# Altium schematic sheet SIM7600x.SchDoc
size A3; SheetNumber: 5; SheetTotal: 7
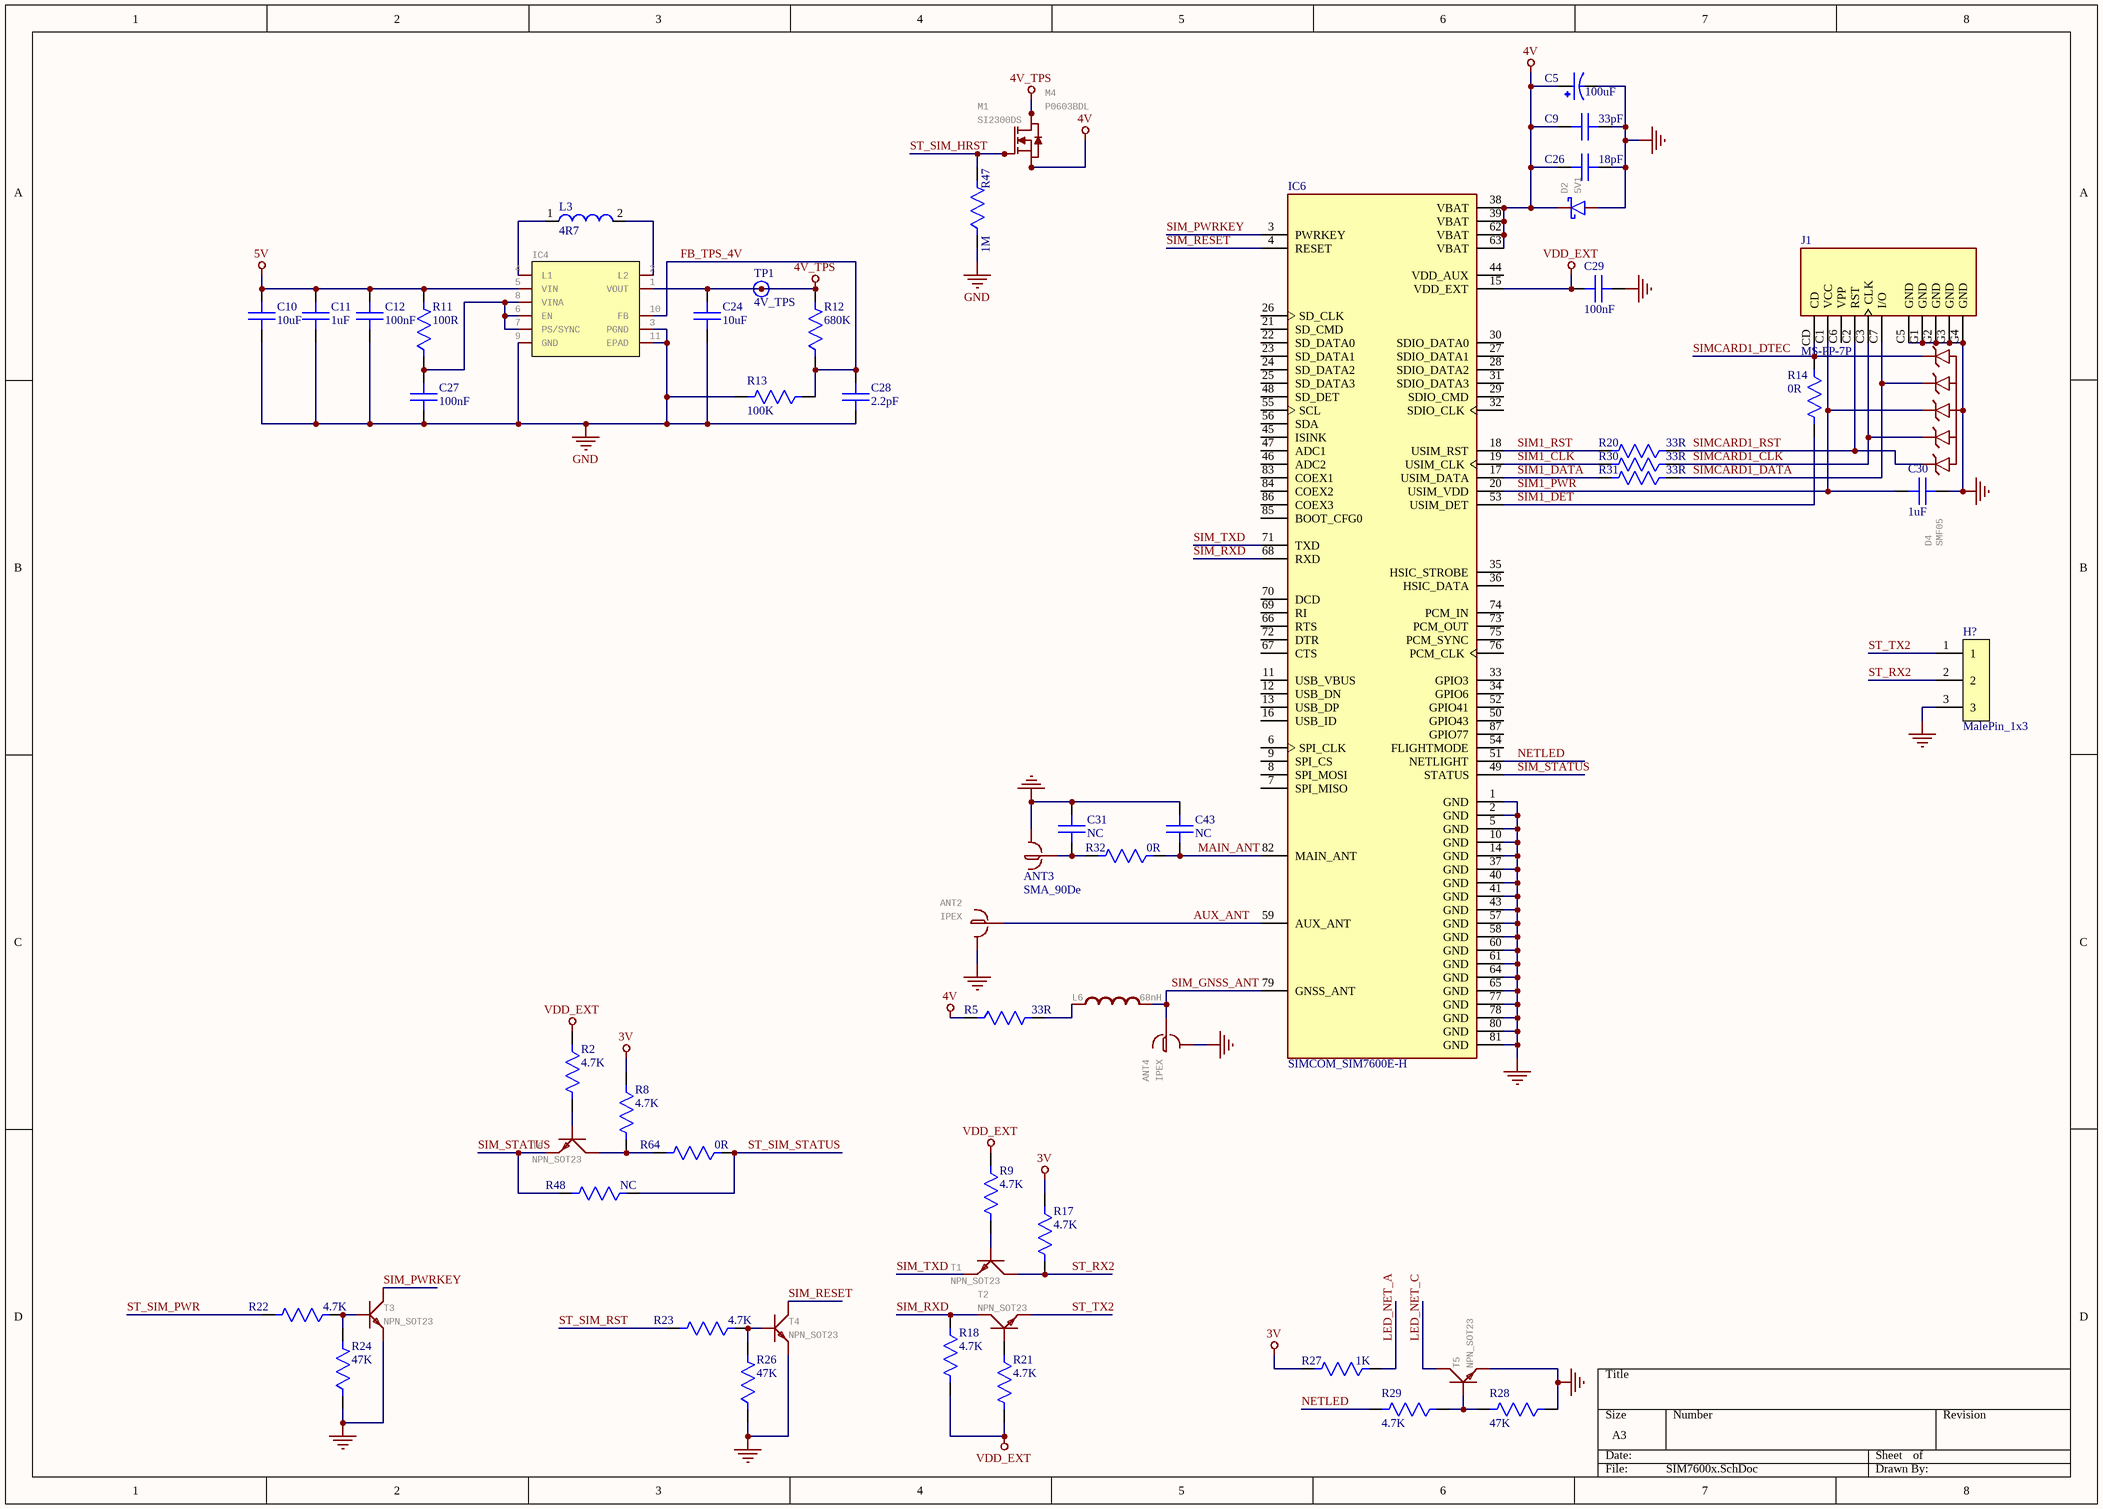
[diagram p0: SIM7600x.SchDoc]

## Parts
ANT2  IPEX  [IPEX]
ANT3  SMA_90De  [SMA_90De]
ANT4  IPEX  [IPEX]
C5  100uF  [1411P]
C9  33pF  [C0603]
C10  10uF  [C0603]
C11  1uF  [C0603]
C12  100nF  [C0603]
C24  10uF  [C0603]
C26  18pF  [C0603]
C27  100nF  [C0603]
C28  2.2pF  [C0603]
C29  100nF  [C0603]
C30  1uF  [C0603]
C31  NC  [C0603]
C43  NC  [C0603]
D2  5V1  [SOD123]
D4  SMF05  [SOT363]
H?  MalePin_1x3  [MALEPIN_1x3]
IC4  TPS63XXX  [VSON-10]  (value not drawn)
IC6  SIMCOM_SIM7600E-H  [SIMCOM_SIM7600E-H]
J1  MS-PP-7P  [GCT_SIM8065-6-1-14-01-A_REVA1]
L3  4R7  [L0420]
L6  68nH  [C0603]
M1  SI2300DS  [SOT23]
M4  P0603BDL  [TO252-3]
R2  4.7K  [R0603]
R5  33R  [R0603]
R8  4.7K  [R0603]
R9  4.7K  [R0603]
R11  100R  [R0603]
R12  680K  [R0603]
R13  100K  [R0603]
R14  0R  [R0603]
R17  4.7K  [R0603]
R18  4.7K  [R0603]
R20  33R  [R0603]
R21  4.7K  [R0603]
R22  4.7K  [R0603]
R23  4.7K  [R0603]
R24  47K  [R0603]
R26  47K  [R0603]
R27  1K  [R0603]
R28  47K  [R0603]
R29  4.7K  [R0603]
R30  33R  [R0603]
R31  33R  [R0603]
R32  0R  [R0603]
R47  1M  [R0603]
R48  NC  [R0603]
R64  0R  [R0603]
T1  NPN_SOT23  [SOT23]
T2  NPN_SOT23  [SOT23]
T3  NPN_SOT23  [SOT23]
T4  NPN_SOT23  [SOT23]
T5  NPN_SOT23  [SOT23]
T6  NPN_SOT23  [SOT23]
TP1  4V_TPS  [TestPoint_1MM]

## Nets
3V: R8.1 R17.1 R27.2
4V: C5.1 C9.1 C26.1 D2.C IC6.38(VBAT) IC6.39(VBAT) IC6.62(VBAT) IC6.63(VBAT) M1.2(S) M4.2(S) R5.1
4V_TPS: C24.1 IC4.1(VOUT) M1.3(D) M4.3(D) R12.2 TP1.1
5V: C10.1 C11.1 C12.1 IC4.5(VIN) R11.2
GND: ANT2.2,3(GND) ANT3.2,_3,_4,_5(GND) ANT4.2,3(GND) C5.2 C9.2 C10.2 C11.2 C12.2 C24.2 C26.2 C27.2 C28.2 C29.2 C30.2 C31.2 C43.2 D2.A D4.2(A) H?.3 IC4.3(PGND) IC4.9(GND) IC4.11(EPAD) IC6.1(GND) IC6.2(GND) IC6.5(GND) IC6.10(GND) IC6.14(GND) IC6.37(GND) IC6.40(GND) IC6.41(GND) IC6.43(GND) IC6.57(GND) IC6.58(GND) IC6.60(GND) IC6.61(GND) IC6.64(GND) IC6.65(GND) IC6.77(GND) IC6.78(GND) IC6.80(GND) IC6.81(GND) J1.C5(GND) J1.G1(GND) J1.G2(GND) J1.G3(GND) J1.G4(GND) R13.2 R24.1 R26.1 R28.1 R47.1 T3.2(E) T4.2(E) T5.2(E)
VDD_EXT: C29.1 IC6.15(VDD_EXT) R2.1 R9.1 R18.2 R21.2
AUX_ANT: ANT2.1(SIG) IC6.59(AUX_ANT)
FB_TPS_4V: C28.1 IC4.10(FB) R12.1 R13.1
LED_NET_A: R27.1
LED_NET_C: T5.3(C)
MAIN_ANT: C43.1 IC6.82(MAIN_ANT) R32.1
NETLED: IC6.51(NETLIGHT) R29.2
SIM1_CLK: IC6.19(USIM_CLK) R30.2
SIM1_DATA: IC6.17(USIM_DATA) R31.2
SIM1_DET: IC6.53(USIM_DET) R14.2
SIM1_PWR: C30.1 D4.4(C3) IC6.20(USIM_VDD) J1.C1(VCC)
SIM1_RST: IC6.18(USIM_RST) R20.2
SIM_GNSS_ANT: ANT4.1(SIG) IC6.79(GNSS_ANT) L6.2
SIM_PWRKEY: IC6.3(PWRKEY) T3.3(C)
SIM_RESET: IC6.4(RESET) T4.3(C)
SIM_RXD: IC6.68(RXD) R18.1 T2.3(C)
SIM_STATUS: IC6.49(STATUS) R48.2 T6.2(E)
SIM_TXD: IC6.71(TXD) T1.2(E)
SIMCARD1_CLK: D4.3(C2) J1.C3(CLK) R30.1
SIMCARD1_DATA: D4.5(C4) J1.C7(I/O) R31.1
SIMCARD1_DTEC: D4.6(C5) J1.CD R14.1
SIMCARD1_RST: D4.1(C1) J1.C2(RST) R20.1
ST_RX2: H?.2 R17.2 T1.3(C)
ST_SIM_HRST: M1.1(G) M4.1(G) R47.2
ST_SIM_PWR: R22.2
ST_SIM_RST: R23.2
ST_SIM_STATUS: R48.1 R64.1
ST_TX2: H?.1 T2.2(E)
NetANT3_1: ANT3.1(SIG) C31.1 R32.2
NetC27_1: C27.1 IC4.6(EN) IC4.7(PS/SYNC) IC4.8(VINA) R11.1
NetIC4_2: IC4.2(L2) L3.2
NetIC4_4: IC4.4(L1) L3.1
NetL6_1: L6.1 R5.2
NetR2_2: R2.2 T6.1(B)
NetR8_2: R8.2 R64.2 T6.3(C)
NetR9_2: R9.2 T1.1(B)
NetR21_1: R21.1 T2.1(B)
NetR22_1: R22.1 R24.2 T3.1(B)
NetR23_1: R23.1 R26.2 T4.1(B)
NetR28_2: R28.2 R29.1 T5.1(B)

Not connected (* = marked no-connect by the designer): IC6 6(SPI_CLK) 7(SPI_MISO) 8(SPI_MOSI) 9(SPI_CS) 11(USB_VBUS) 12(USB_DN) 13(USB_DP) 16(USB_ID) 21(SD_CMD) 22(SD_DATA0) 23(SD_DATA1) 24(SD_DATA2) 25(SD_DATA3) 26(SD_CLK) 27(SDIO_DATA1) 28(SDIO_DATA2) 29(SDIO_CMD) 30(SDIO_DATA0) 31(SDIO_DATA3) 32(SDIO_CLK) 33(GPIO3) 34(GPIO6) 35(HSIC_STROBE) 36(HSIC_DATA) 44(VDD_AUX) 45(ISINK) 46(ADC2) 47(ADC1) 48(SD_DET) 50(GPIO43) 52(GPIO41) 54(FLIGHTMODE) 55(SCL) 56(SDA) 66(RTS) 67(CTS) 69(RI) 70(DCD) 72(DTR) 73(PCM_OUT) 74(PCM_IN) 75(PCM_SYNC) 76(PCM_CLK) 83(COEX1) 84(COEX2) 85(BOOT_CFG0) 86(COEX3) 87(GPIO77); J1 C6(VPP)

## Library data of the parts
ANT2 ANT4 = IPEX: GateName_1: G$1; SymbolName_1: ANTENNA; LibraryName: Dkoi; DeviceSetName: IPEX; Package: IPEX
C5 = CAP_TAN_1411: Aluminum Electrolytic Capacitors - Radial Leaded 50VDC 1200uF 10000H 16x25mm; MF: Panasonic; MP: EEU-FS1H122; Price: None; Value: *; Availability: In Stock; Check_prices: https://www.snapeda.com/parts/EEU-FS1H122/Panasonic/view-part/?ref=eda; Purchase-URL: https://pricing.snapeda.com/search/part/EEU-FS1H122/?ref=eda; SnapEDA_Link: https://www.snapeda.com/parts/EEU-FS1H122/Panasonic/view-part/?ref=snap; Package: RADIAL-2 Panasonic
C9-C12 C24 C26-C31 C43 = Capacitor
D2 = Zenner_SOD123: GateName_1: G$1; SymbolName_1: DIODE_S; DeviceSetName: SS54F; LibraryName: Uy_SMD; Package: SMAF
D4 = SMF05: GateName_1: G$1; SymbolName_1: SMF05; LibraryName: Uy_SMD; DeviceSetName: SMF05; Package: SC7-6
IC4 = TPS63XXX: High-Efficient Single Inductor Buck-Boost Converter With 1.8A Switches; GateName_1: G$1; SymbolName_1: TPS6300X; LibraryName: Uy_SMD; DeviceSetName: TPS63XXX; Package: VSON-10
IC6 = SIMCOM_SIM7600E-H: Multi-Band LTE-TDD/LTE-FDD/HSPA+ and GSM/GPRS/EDGE module; Availability: Unavailable; MP: SIM7600E-H; Value: *; Package: None; Price: None
J1 = MS-PP-7P: Nano SIM Card Connector Push-Push Type, SMT, 6pin, 1.37mm Profile; MP: SIM8065-6-1-14-01-A_REVA1; Package: None; Availability: Unavailable; Value: *; Price: None
L3 = Inductor 0420
L6 = Inductor 0603: GateName_1: G$1; SymbolName_1: L; DeviceSetName: L0603; LibraryName: Uy_SMD; Package: 0603
M1 = MOSFETN_SOT23: SOT-23; GateName_1: G$1; SymbolName_1: MOSFET_N; LibraryName: Uy_SMD; DeviceSetName: MOSFETN; Package: SOT23(1)
M4 = MOSFETN_TO252: SOT-23; GateName_1: G$1; SymbolName_1: MOSFET_N; LibraryName: Uy_SMD; DeviceSetName: MOSFETN; Package: SOT23(1)
R2 R5 R8 R9 R11-R14 R17 R18 R20-R24 R26-R32 R47 R48 R64 = Resistor: SMD Resistor 0603; Manufacturer: Yageo; Manufacturer Part Number: RC0603FR-071KL; Power Rating: 100mW; Tolerance: 1%; Value: 1kR; Temperature Coefficient: 100ppm/°C; Voltage Rating: 50V; Supplier: Digi-Key; Supplier Part Number: 311-1.00KHRDKR-ND; RoHS: Yes; Category: Chip SMD Resistors; Stock: 18662657; Pricing: 1=0.1, 10=0.018, 50=0.0106, 100=0.0088, 500=0.00592, 1000=0.00505 (USD); Case/Package: 0603; Case Code (Imperial): 0603; Case Code (Metric): 1608; Contact Plating: Tin,Matte; Min Operating Temperature: -55°C; Max Operating Temperature: 155°C; Packaging: Tape and Reel; Resistor Type: Thick Film; Termination: SMD/SMT; Features: Moisture Resistant; Series: RC; Max Power Dissipation: 100mW; Number of Terminations: 2; Resistance Tolerance: 1%; Construction: Rectangular; Technology: THICK FILM; Length: 1.6mm; Height: 0.45mm; Depth: 0.8mm; Reach SVHC Compliant: No; Military Standard: Not; Lead Free: 5697LeadFree; RoHS Compliant: Yes
T1-T6 = NPN_SOT23: BJT SOT23; GateName_1: G$1; SymbolName_1: NPN; LibraryName: Uy_SMD; DeviceSetName: NPN; Package: SOT23(1)
TP1 = TestPoint_1MM